# EAGLE design sch_shield (EAGLE 9.6.2)
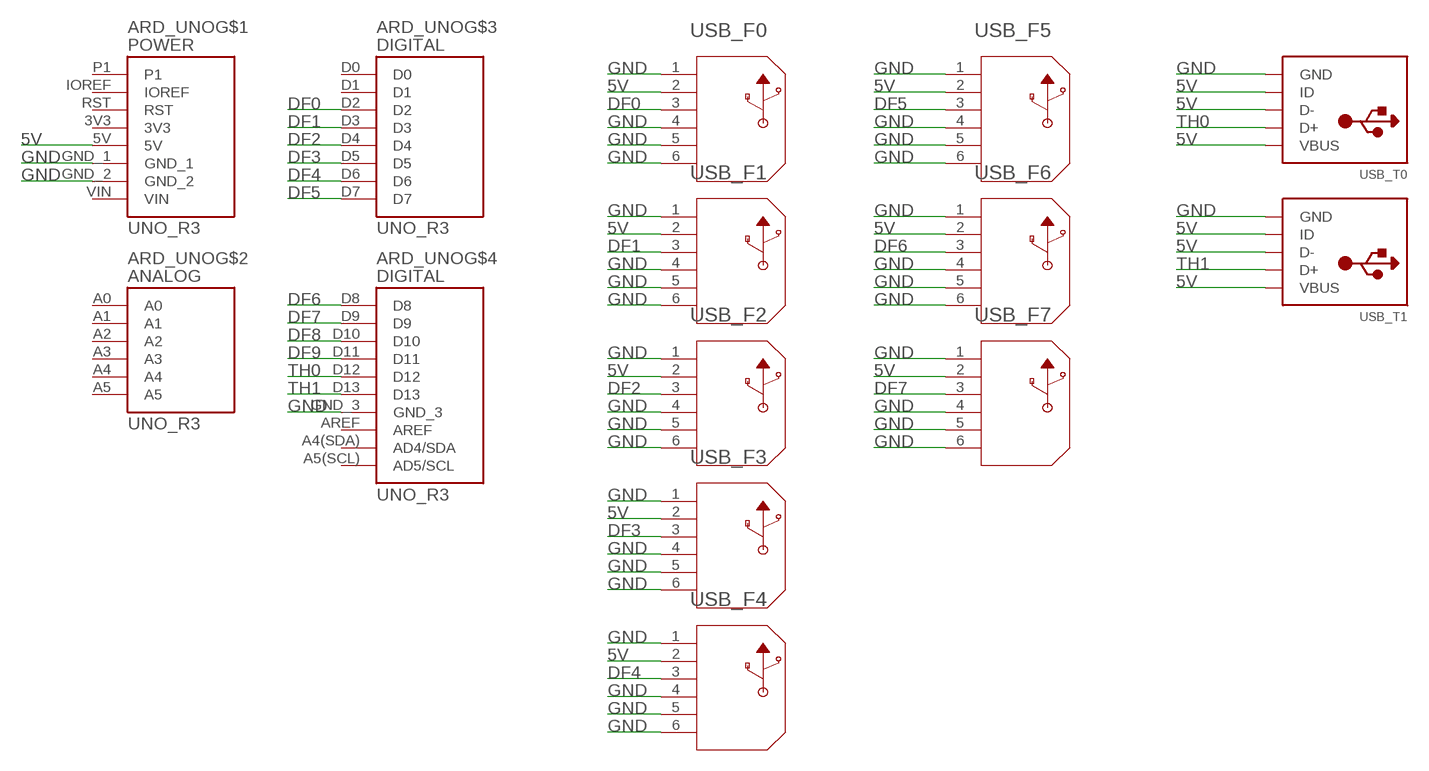
[diagram p0: schematic, sheet 1]

## Parts
ARD_UNO  UNO_R3  [ARDUINO_UNO_R3]
USB_F0  292303-3  [CONN4_292303_TEC]
USB_F1  292303-3  [CONN4_292303_TEC]
USB_F2  292303-3  [CONN4_292303_TEC]
USB_F3  292303-3  [CONN4_292303_TEC]
USB_F4  292303-3  [CONN4_292303_TEC]
USB_F5  292303-3  [CONN4_292303_TEC]
USB_F6  292303-3  [CONN4_292303_TEC]
USB_F7  292303-3  [CONN4_292303_TEC]
USB_T0  USBTHM  [USB-MINIB-THM]
USB_T1  USBTHM  [USB-MINIB-THM]

## Nets
5V: ARD_UNO.5V USB_F0.2 USB_F1.2 USB_F2.2 USB_F3.2 USB_F4.2 USB_F5.2 USB_F6.2 USB_F7.2 USB_T0.D- USB_T0.ID USB_T0.VBUS USB_T1.D- USB_T1.ID USB_T1.VBUS
DF0: ARD_UNO.D2 USB_F0.3
DF1: ARD_UNO.D3 USB_F1.3
DF2: ARD_UNO.D4 USB_F2.3
DF3: ARD_UNO.D5 USB_F3.3
DF4: ARD_UNO.D6 USB_F4.3
DF5: ARD_UNO.D7 USB_F5.3
DF6: ARD_UNO.D8 USB_F6.3
DF7: ARD_UNO.D9 USB_F7.3
DF8: ARD_UNO.D10
DF9: ARD_UNO.D11
GND: ARD_UNO.GND_1 ARD_UNO.GND_2 ARD_UNO.GND_3 USB_F0.1 USB_F0.4 USB_F0.5 USB_F0.6 USB_F1.1 USB_F1.4 USB_F1.5 USB_F1.6 USB_F2.1 USB_F2.4 USB_F2.5 USB_F2.6 USB_F3.1 USB_F3.4 USB_F3.5 USB_F3.6 USB_F4.1 USB_F4.4 USB_F4.5 USB_F4.6 USB_F5.1 USB_F5.4 USB_F5.5 USB_F5.6 USB_F6.1 USB_F6.4 USB_F6.5 USB_F6.6 USB_F7.1 USB_F7.4 USB_F7.5 USB_F7.6 USB_T0.GND USB_T1.GND
TH0: ARD_UNO.D12 USB_T0.D+
TH1: ARD_UNO.D13 USB_T1.D+
Unconnected: ARD_UNO.A0 ARD_UNO.A1 ARD_UNO.A2 ARD_UNO.A3 ARD_UNO.A4 ARD_UNO.A4(SDA)(AD4/SDA) ARD_UNO.A5 ARD_UNO.A5(SCL)(AD5/SCL) ARD_UNO.AREF ARD_UNO.D0 ARD_UNO.D1 ARD_UNO.IOREF ARD_UNO.P1 ARD_UNO.RST

## Power pins joined to a net without a drawn wire
3V3: ARD_UNO.3V3
VIN: ARD_UNO.VIN

## Library data of the parts
ARD_UNO = UNO_R3:UNO_R3: Arduino Uno R3 (Atmega328 - assembled) Check prices <https://pricing.snapeda.com/parts/UNO%20R3/Arduino/view-part?ref=eda>; AVAILABILITY: No availability data; DESCRIPTION: ATmega328P Arduino Uno R3 AVR® ATmega AVR MCU 8-Bit Embedded Evaluation Board; MF: Arduino; MP: UNO R3; PACKAGE: None; PRICE: None
USB_F0 USB_F1-USB_F7 = USB_A_TH:292303-3; BUILT_BY: EMA_UL_Team; COPYRIGHT: Copyright (C) 2016 Accelerated Designs. All rights reserved; DESCRIPTION: USB A R/A RCPT ASSY THRU HOLE, LEAD FREE; MANUFACTURER_PART_NUMBER: 292303-3; PITCH_MM_: 2.5; POSITIONS: 4; PRODUCT: Connector; ROWS-CONFIG: 1; SOURCELIBRARY: TE_Connectivity-2018-03-16; TE_PART_NUMBER: 292303-3; TYPE: USB 2.0; VENDOR: TE Connectivity
USB_T0 USB_T1 = adafruit:USB: USB Connectors USBMINIB - Surface Mount Female Mini-B USB Connector 4UConnector: 06564 By microbuilder.eu Thru-hole RA Female Mini-B USB Connector 4UConnector: 18732 By ladyada.net

## Board
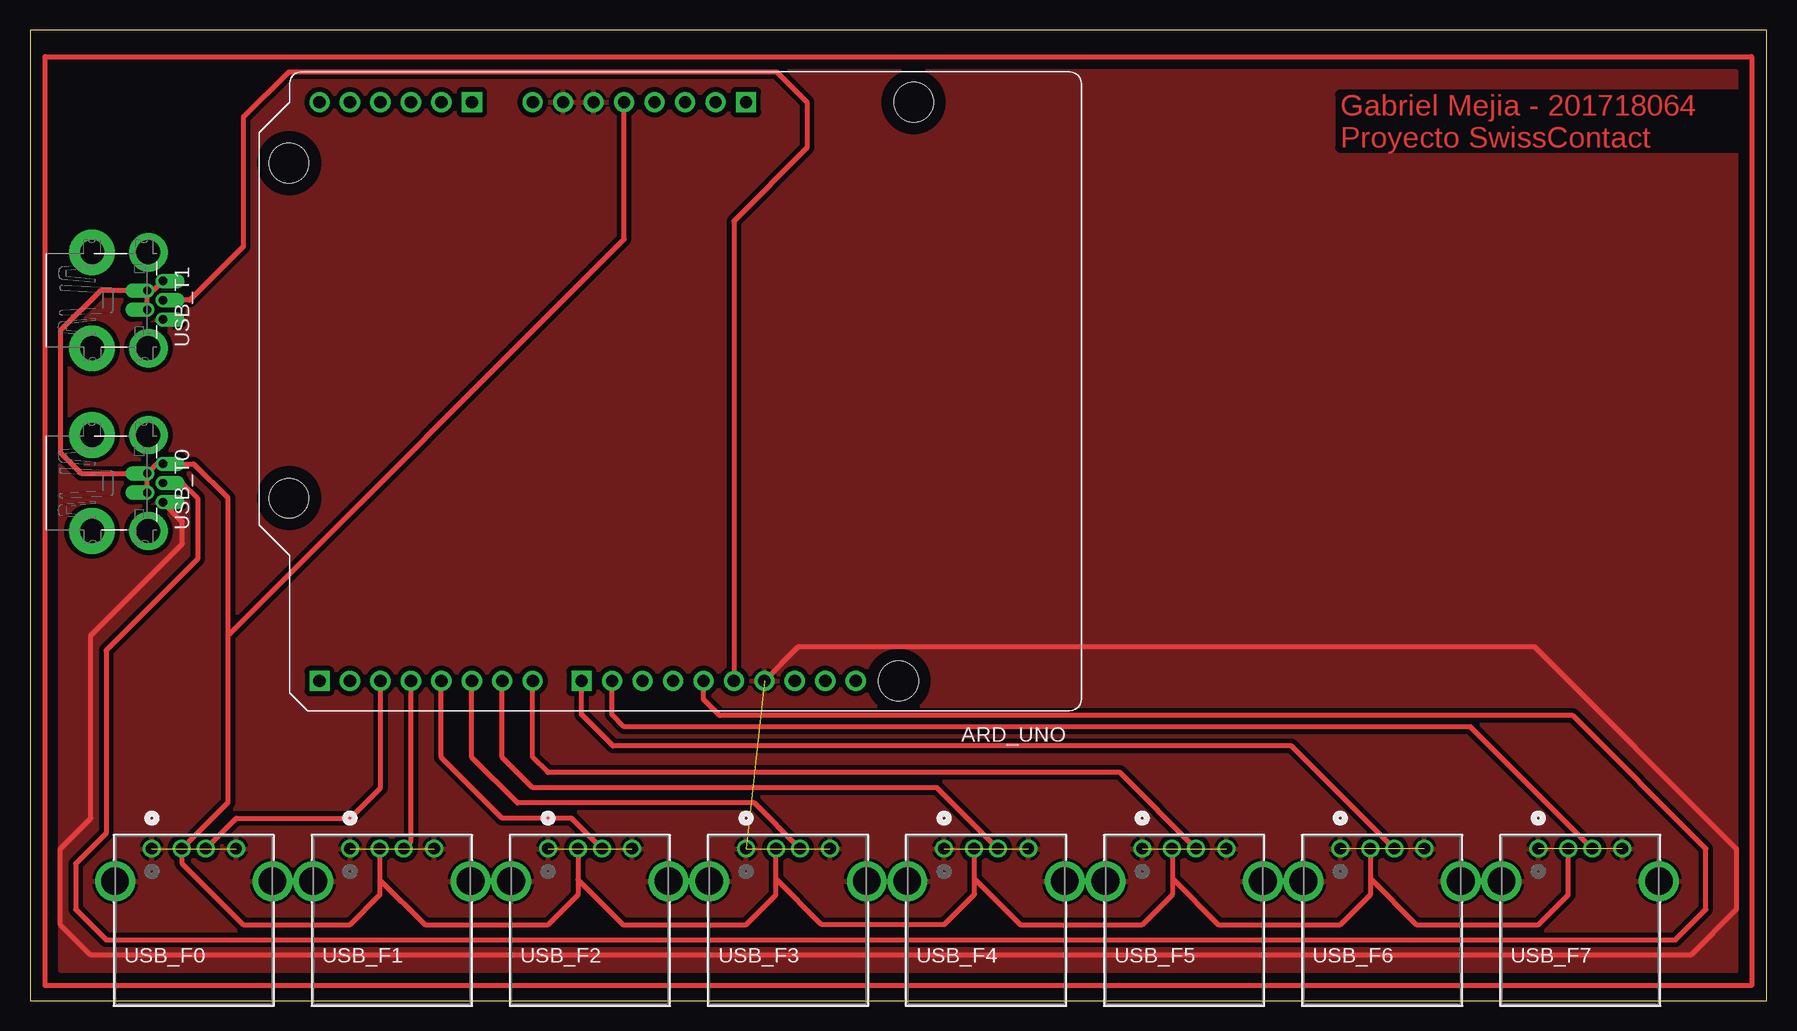
[diagram p1: board, top side]
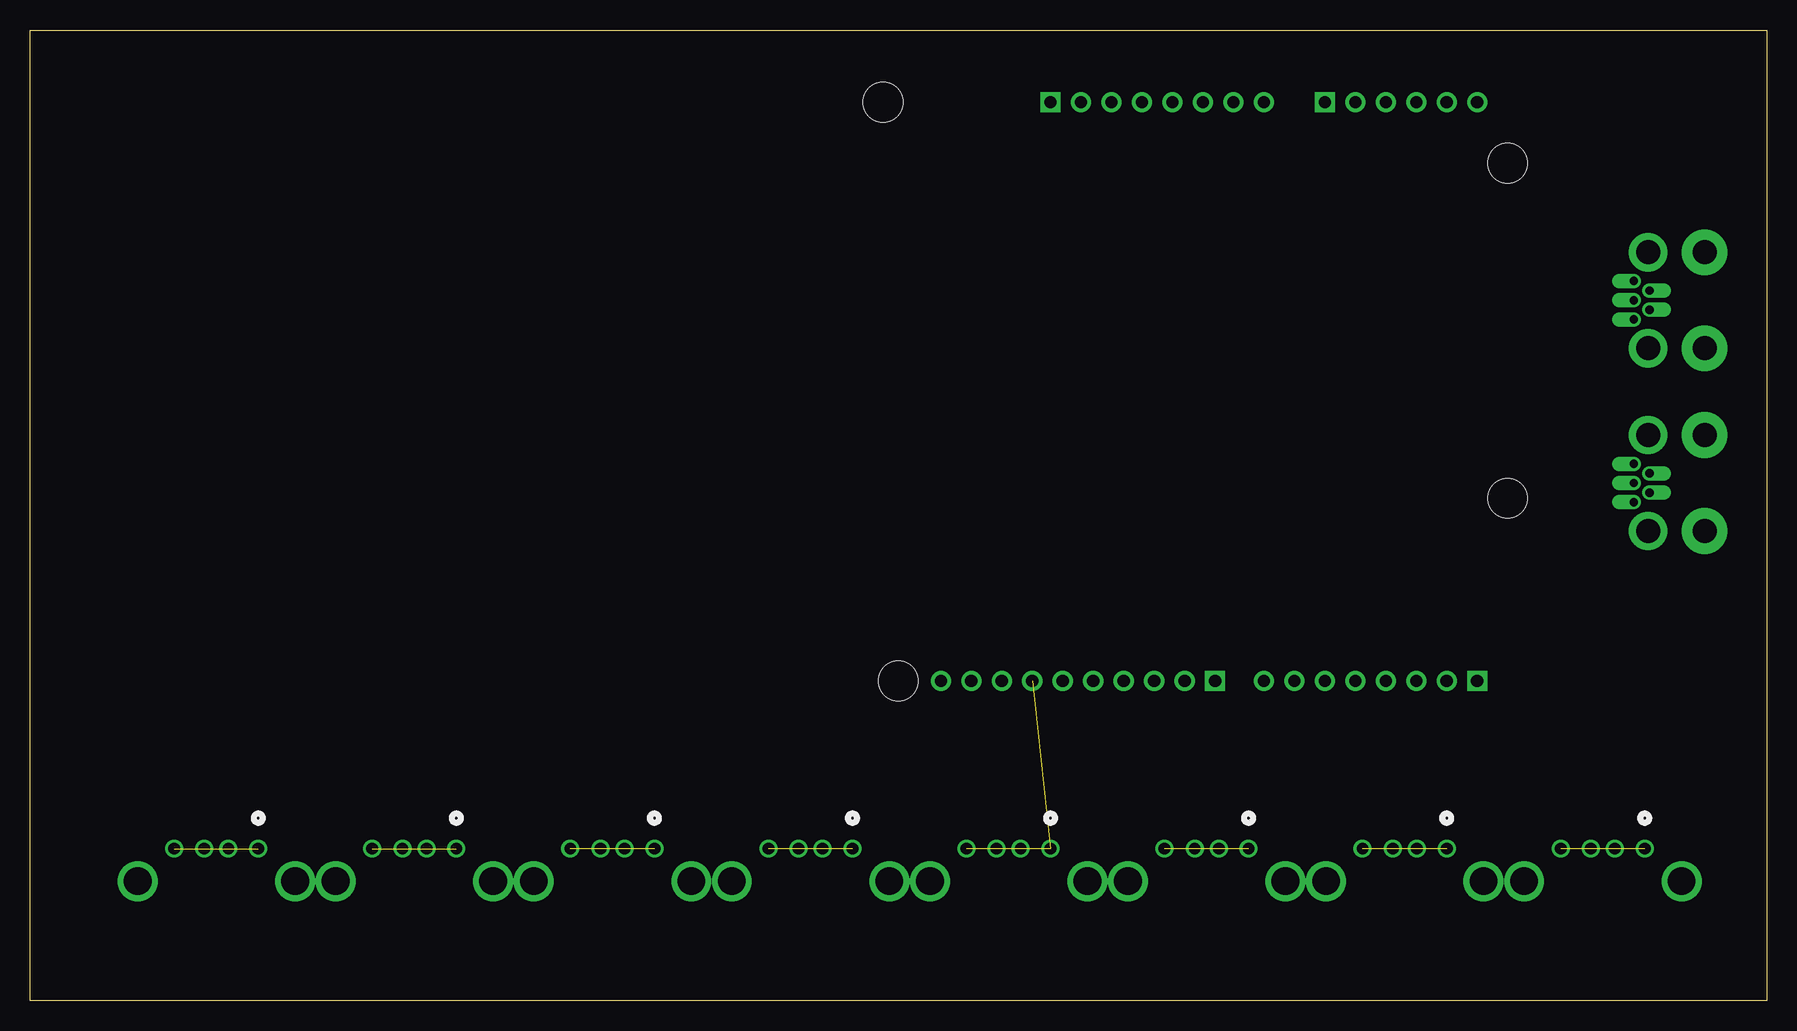
[diagram p2: board, bottom side, seen from below]

Size 144.76 x 80.95 mm. Coordinates in mm from the lower left corner, seen from the top.
Outline: 0,0 144.76,0 144.76,80.95 0,80.95 0,0
Copper layers (1*16): Top 0.035mm / dielectric 1.5mm / Bottom 0.035mm
Design rules "default": minimum track width 6mil, minimum drill 0.35mm, track to track 6mil, track to pad 6mil, pad to pad 6mil, via to via 6mil, smd to smd 6mil, copper to edge 40mil, drill to drill 6mil, minimum pad ring 10mil, minimum via ring 8mil, stop-mask expansion 4mil, vias tented up to drill 0mil, thermal gap 10mil

### Footprints (pad centres in the part's own frame; a part is rotated, then mirrored left to right if it is on the bottom)
ARDUINO_UNO_R3 = drill 1.016 pad 1.676: 3V3 35.56,2.54; 5V 38.1,2.54; A1 53.34,2.54; A2 55.88,2.54; A3 58.42,2.54; A4 60.96,2.54; A4(SDA) 21.336,50.8; A5 63.5,2.54; A5(SCL) 18.796,50.8; AREF 23.876,50.8; D1 60.96,50.8; D2 58.42,50.8; D3 55.88,50.8; D4 53.34,50.8; D5 50.8,50.8; D6 48.26,50.8; D7 45.72,50.8; D9 39.116,50.8; D10 36.576,50.8; D11 34.036,50.8; D12 31.496,50.8; D13 28.956,50.8; GND_1 43.18,2.54; GND_2 40.64,2.54; GND_3 26.416,50.8; IOREF 30.48,2.54; RST 33.02,2.54; VIN 45.72,2.54 | drill 1.016 pad 1.676 square: A0 50.8,2.54; D0 63.5,50.8; D8 41.656,50.8; P1 27.94,2.54 | hole 3.3: 66.04,35.56; 66.04,7.62; 15.24,50.8; 13.97,2.54
CONN4_292303_TEC = drill 0.991 pad 1.499: 1 0,0; 2 2.489,0; 3 4.496,0; 4 7.01,0 | drill 2.311 pad 2.819: 5 -3.073,-2.718; 6 10.058,-2.718
USB-MINIB-THM = drill 0.7 offset: D+ 0,9.8; D- -0.8,8.5; GND 1.6,9.8; ID 0.8,8.5; VBUS -1.6,9.8 | drill 2 pad 3.81: GND1 -4,3.9; GND4 4,3.9 | drill 2 pad 3.2: GND2 -4,8.6; GND3 4,8.6

### Placement (x,y rotation side)
ARD_UNO  87.63,77.47 180 top
USB_F0  10.16,12.7 0 top
USB_F1  26.67,12.7 0 top
USB_F2  43.18,12.7 0 top
USB_F3  59.69,12.7 0 top
USB_F4  76.2,12.7 0 top
USB_F5  92.71,12.7 0 top
USB_F6  109.22,12.7 0 top
USB_F7  125.73,12.7 0 top
USB_T0  1.27,43.18 270 top
USB_T1  1.27,58.42 270 top

### Tracks (layer width: path | path; a pad name or v marks a point on that pad's centre or on a via)
5V
  Top 0.152: USB_T0.VBUS 11.43,44.78 | 10.27,59.22 10.16,59.22 9.77,58.83
  Top 0.406: USB_F1.2 29.16,10.11 | 29.16,10.11 29.16,8.84 26.67,6.35 17.78,6.35 12.65,11.48 USB_F0.2 16.51,16.56 16.51,30.48 | 29.16,10.11 32.92,6.35 43.18,6.35 45.67,8.84 45.67,10.11 | USB_F2.2 45.67,10.11 | 78.74,10.16 82.55,6.35 92.71,6.35 95.25,8.89 95.25,10.16 | USB_F7.2 128.22,8.84 125.73,6.35 115.57,6.35 111.76,10.16 | 16.51,30.48 16.51,41.91 13.64,44.78 11.43,44.78 10.57,44.78 USB_T0.D- | USB_T1.VBUS 10.27,59.22 | 10.16,59.22 USB_T1.D- 5.88,59.22 2.54,55.88 2.54,45.72 4.28,43.98 USB_T0.D- | USB_T1.ID 9.77,58.83 | USB_T0.ID USB_T0.D- | 78.74,10.16 78.74,8.89 76.2,6.35 65.99,6.35 62.18,10.16 | 78.74,10.16 78.74,12.65 USB_F4.2 | 45.67,10.11 49.43,6.35 59.69,6.35 62.18,8.84 62.18,10.16 | 95.25,10.16 95.25,12.65 USB_F5.2 | 95.25,10.16 99.06,6.35 109.22,6.35 111.76,8.89 111.76,10.16 | 111.76,10.16 111.76,12.65 USB_F6.2 | 16.51,30.48 49.53,63.5 ARD_UNO.5V | 62.18,10.16 USB_F3.2
DF0
  Top 0.406: USB_F0.3 17.2,15.24 26.67,15.24 29.21,17.78 ARD_UNO.D2
DF1
  Top 0.406: USB_F1.3 31.75,13.28 ARD_UNO.D3
DF2
  Top 0.406: USB_F2.3 45.14,15.24 39.37,15.24 34.29,20.32 ARD_UNO.D4
DF3
  Top 0.406: USB_F3.3 60.38,16.51 40.64,16.51 36.83,20.32 ARD_UNO.D5
DF4
  Top 0.406: USB_F4.3 75.62,17.78 41.91,17.78 39.37,20.32 ARD_UNO.D6
DF5
  Top 0.406: USB_F5.3 90.86,19.05 43.18,19.05 41.91,20.32 ARD_UNO.D7
DF6
  Top 0.152: 45.97,26.42 ARD_UNO.D8
  Top 0.406: USB_F6.3 105.16,21.26 48.59,21.26 45.97,23.88 ARD_UNO.D8
DF7
  Top 0.406: USB_F7.3 120.07,22.86 49.53,22.86 48.51,23.88 ARD_UNO.D9
GND  (9 unrouted)
  Top 0.406: ARD_UNO.GND_3 64.08,29.54 125.4,29.54 142.24,12.7 142.24,7.62 138.43,3.81 5.08,3.81 2.54,6.35 2.54,12.7 5.08,15.24 5.08,30.48 12.7,38.1 12.7,39.95 USB_T0.GND
  pour Top (isolate 0.406): 142.24,2.54 142.24,77.47 2.54,77.47 2.54,2.54
N$1
  Top 0.406: 1.27,1.27 1.27,78.74 143.51,78.74 143.51,1.27 1.27,1.27
TH0
  Top 0.406: USB_T0.D+ 12.7,43.18 13.97,41.91 13.97,36.83 6.35,29.21 6.35,13.97 3.81,11.43 3.81,7.62 6.35,5.08 137.16,5.08 139.7,7.62 139.7,12.7 128.6,23.8 57.48,23.8 56.13,25.15 ARD_UNO.D12
TH1
  Top 0.406: ARD_UNO.D13 58.67,65.02 64.77,71.12 64.77,74.93 62.23,77.47 21.59,77.47 17.78,73.66 17.78,62.9 13.3,58.42 USB_T1.D+

### Text on the board
Top: Gabriel Mejia - 201718064 / Proyecto SwissContact